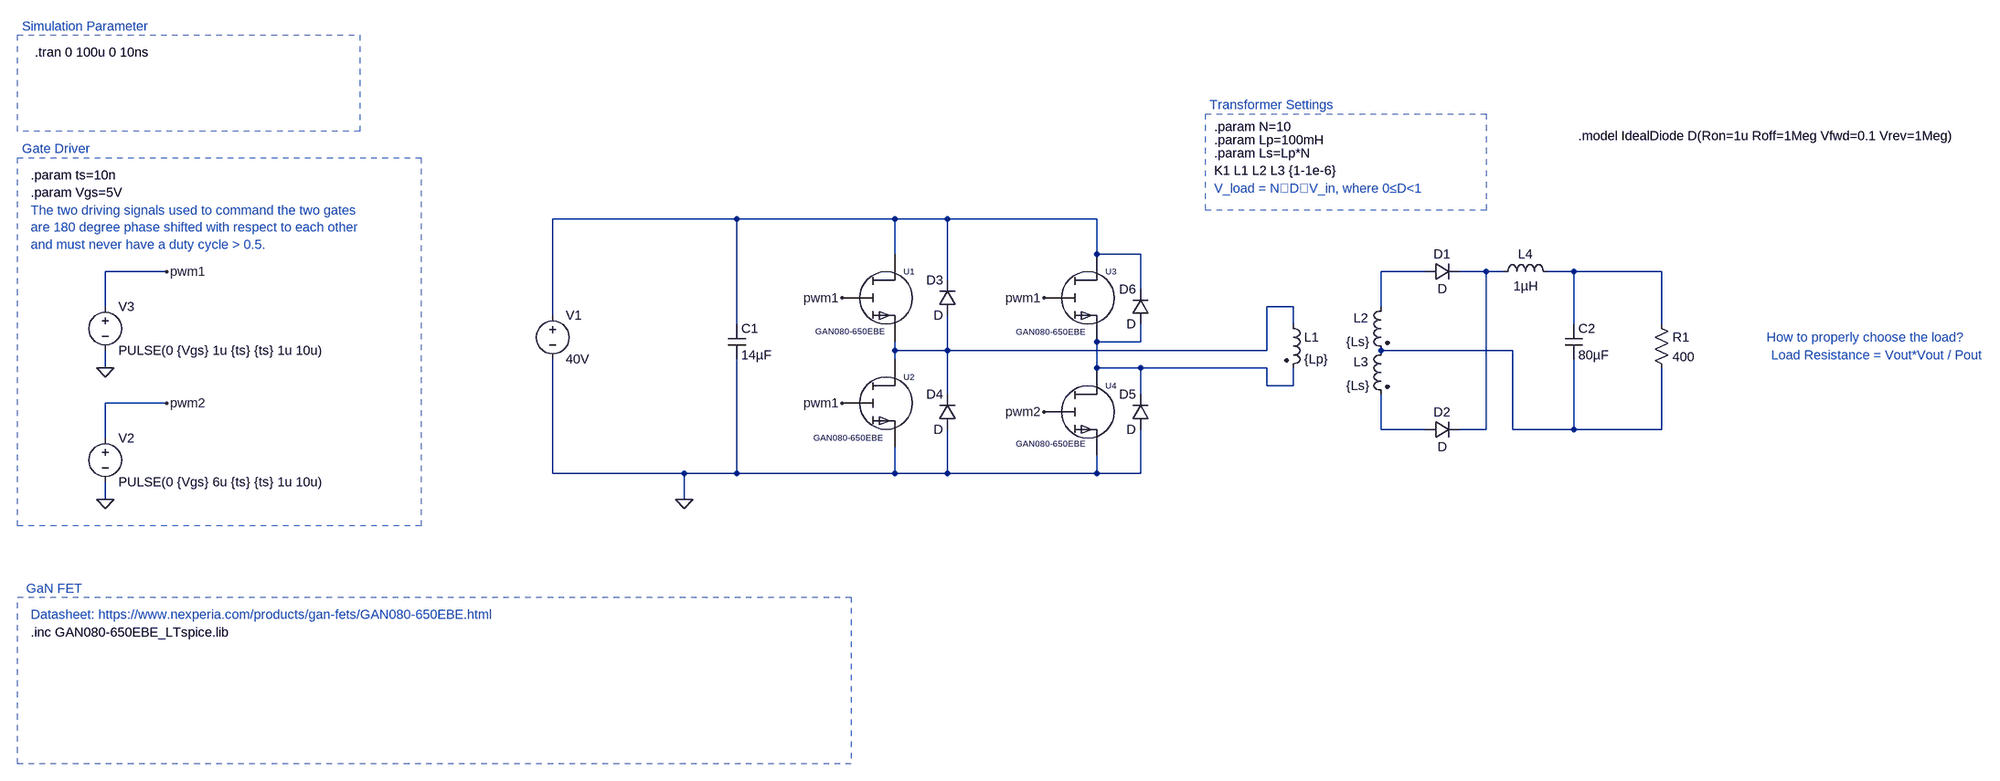
[diagram p0: schematic dc-dc-full-bridge.asc]
dc-dc-full-bridge.asc, the LTspice schematic file:
Version 4
SHEET 1 4648 30344
WIRE 32 -336 -304 -336
WIRE 320 -336 32 -336
WIRE 416 -336 320 -336
WIRE 688 -336 416 -336
WIRE 320 -272 320 -336
WIRE 688 -272 688 -336
WIRE 768 -272 688 -272
WIRE -1008 -240 -1120 -240
WIRE 1328 -240 1248 -240
WIRE 1440 -240 1392 -240
WIRE 1472 -240 1440 -240
WIRE 1600 -240 1552 -240
WIRE 1760 -240 1600 -240
WIRE 416 -224 416 -336
WIRE 768 -208 768 -272
WIRE -1120 -176 -1120 -240
WIRE 1088 -176 1040 -176
WIRE 1248 -176 1248 -240
WIRE -304 -160 -304 -336
WIRE 32 -144 32 -336
WIRE 1088 -144 1088 -176
WIRE 1600 -144 1600 -240
WIRE 1760 -144 1760 -240
WIRE 768 -112 768 -144
WIRE 768 -112 688 -112
WIRE 320 -96 320 -112
WIRE 416 -96 416 -160
WIRE 416 -96 320 -96
WIRE 1040 -96 1040 -176
WIRE 1040 -96 416 -96
WIRE 1488 -96 1248 -96
WIRE 320 -80 320 -96
WIRE -1120 -64 -1120 -96
WIRE 688 -64 688 -112
WIRE 768 -64 688 -64
WIRE 1040 -64 768 -64
WIRE 1040 -32 1040 -64
WIRE 1088 -32 1088 -64
WIRE 1088 -32 1040 -32
WIRE 416 -16 416 -96
WIRE 768 -16 768 -64
WIRE -1008 0 -1120 0
WIRE 1248 48 1248 -16
WIRE 1328 48 1248 48
WIRE 1440 48 1440 -240
WIRE 1440 48 1392 48
WIRE 1488 48 1488 -96
WIRE 1600 48 1600 -80
WIRE 1600 48 1488 48
WIRE 1760 48 1760 -64
WIRE 1760 48 1600 48
WIRE -1120 64 -1120 0
WIRE -304 128 -304 -80
WIRE -64 128 -304 128
WIRE 32 128 32 -80
WIRE 32 128 -64 128
WIRE 320 128 320 80
WIRE 320 128 32 128
WIRE 416 128 416 48
WIRE 416 128 320 128
WIRE 688 128 688 96
WIRE 688 128 416 128
WIRE 768 128 768 48
WIRE 768 128 688 128
WIRE -1120 176 -1120 144
WIRE -64 176 -64 128
FLAG -64 176 0
FLAG -1120 176 0
FLAG -1008 0 pwm2
FLAG -1120 -64 0
FLAG -1008 -240 pwm1
FLAG 224 -192 pwm1
FLAG 224 0 pwm1
FLAG 592 16 pwm2
FLAG 592 -192 pwm1
SYMBOL cap 16 -144 R0
SYMATTR InstName C1
SYMATTR Value 14µF
SYMBOL ind2 1072 -160 R0
SYMATTR InstName L1
SYMATTR Value {Lp}
SYMATTR Type ind
SYMBOL ind2 1264 -192 M0
WINDOW 0 39 37 Left 2
WINDOW 3 37 80 Left 2
SYMATTR InstName L2
SYMATTR Value {Ls}
SYMATTR Type ind
SYMBOL voltage -1120 48 R0
SYMATTR InstName V2
SYMATTR Value PULSE(0 {Vgs} 6u {ts} {ts} 1u 10u)
SYMBOL voltage -1120 -192 R0
SYMATTR InstName V3
SYMATTR Value PULSE(0 {Vgs} 1u {ts} {ts} 1u 10u)
SYMBOL GAN080-650EBE 304 -192 R0
WINDOW 3 -129 61 Left 1
SYMATTR InstName U1
SYMBOL GAN080-650EBE 304 0 R0
WINDOW 3 -132 63 Left 1
SYMATTR InstName U2
SYMBOL voltage -304 -176 R0
SYMATTR InstName V1
SYMATTR Value 40V
SYMBOL GAN080-650EBE 672 -192 R0
WINDOW 3 -131 62 Left 1
SYMATTR InstName U3
SYMBOL GAN080-650EBE 672 16 R0
WINDOW 3 -131 58 Left 1
SYMATTR InstName U4
SYMBOL ind2 1264 -112 M0
WINDOW 0 39 37 Left 2
WINDOW 3 37 80 Left 2
SYMATTR InstName L3
SYMATTR Value {Ls}
SYMATTR Type ind
SYMBOL diode 1328 -224 R270
WINDOW 0 32 32 VTop 2
WINDOW 3 0 32 VBottom 2
SYMATTR InstName D1
SYMBOL diode 1328 64 R270
WINDOW 0 32 32 VTop 2
WINDOW 3 0 32 VBottom 2
SYMATTR InstName D2
SYMBOL cap 1584 -144 R0
SYMATTR InstName C2
SYMATTR Value 80µF
SYMBOL res 1744 -160 R0
SYMATTR InstName R1
SYMATTR Value 400
SYMBOL ind 1456 -224 R270
WINDOW 0 32 56 VTop 2
WINDOW 3 5 56 VBottom 2
SYMATTR InstName L4
SYMATTR Value 1µH
SYMBOL diode 432 -160 R180
WINDOW 0 24 64 Left 2
WINDOW 3 24 0 Left 2
SYMATTR InstName D3
SYMBOL diode 432 48 R180
WINDOW 0 24 64 Left 2
WINDOW 3 24 0 Left 2
SYMATTR InstName D4
SYMBOL diode 784 48 R180
WINDOW 0 24 64 Left 2
WINDOW 3 24 0 Left 2
SYMATTR InstName D5
SYMBOL diode 784 -144 R180
WINDOW 0 24 64 Left 2
WINDOW 3 24 0 Left 2
SYMATTR InstName D6
TEXT 944 -504 Left 2 !.param N=10
TEXT 944 -480 Left 2 !.param Lp=100mH
TEXT 944 -456 Left 2 !.param Ls=Lp*N
TEXT 944 -424 Left 2 !K1 L1 L2 L3 {1-1e-6}
TEXT 1608 -488 Left 2 !.model IdealDiode D(Ron=1u Roff=1Meg Vfwd=0.1 Vrev=1Meg)
TEXT -1272 -464 Left 2 ;Gate Driver
TEXT -1256 -416 Left 2 !.param ts=10n
TEXT -1256 -384 Left 2 !.param Vgs=5V
TEXT -1264 368 Left 2 ;GaN FET
TEXT -1248 -640 Left 2 !.tran 0 100u 0 10ns
TEXT -1256 448 Left 2 !.inc GAN080-650EBE_LTspice.lib
TEXT -1272 -688 Left 2 ;Simulation Parameter
TEXT -1256 416 Left 2 ;Datasheet: https://www.nexperia.com/products/gan-fets/GAN080-650EBE.html
TEXT -1256 -352 Left 2 ;The two driving signals used to command the two gates\nare 180 degree phase shifted with respect to each other\nand must never have a duty cycle > 0.5.
TEXT 1952 -120 Left 2 ;How to properly choose the load?
TEXT 936 -544 Left 2 ;Transformer Settings
TEXT 1960 -88 Left 2 ;Load Resistance = Vout*Vout / Pout
TEXT 944 -392 Left 2 ;V_load = N⋅D⋅V_in, where 0≤D<1
RECTANGLE Normal -544 224 -1280 -448 2
RECTANGLE Normal -656 -496 -1280 -672 2
RECTANGLE Normal 240 688 -1280 384 2
RECTANGLE Normal 1440 -352 928 -528 2

The netlist it stands for:
* dc-dc-full-bridge.asc
C1 N001 0 14µF
L1 N005 N006 {Lp}
L2 N002 N007 {Ls}
V2 pwm2 0 PULSE(0 {Vgs} 6u {ts} {ts} 1u 10u)
V3 pwm1 0 PULSE(0 {Vgs} 1u {ts} {ts} 1u 10u)
XU1 pwm1 N001 N005 GAN080-650EBE  ; pins Gate Drain Source
XU2 pwm1 N005 0 GAN080-650EBE  ; pins Gate Drain Source
V1 N001 0 40V
XU3 pwm1 N001 N006 GAN080-650EBE  ; pins Gate Drain Source
XU4 pwm2 N006 0 GAN080-650EBE  ; pins Gate Drain Source
L3 N007 N008 {Ls}
D1 N002 N003 D
D2 N008 N003 D
C2 N004 N007 80µF
R1 N004 N007 400
L4 N003 N004 1µH
D3 N005 N001 D
D4 0 N005 D
D5 0 N006 D
D6 N006 N001 D
.model D D
.lib standard.dio
.param N=10
.param Lp=100mH
.param Ls=Lp*N
K1 L1 L2 L3 {1-1e-6}
.model IdealDiode D(Ron=1u Roff=1Meg Vfwd=0.1 Vrev=1Meg)
* Gate Driver
.param ts=10n
.param Vgs=5V
* GaN FET
.tran 0 100u 0 10ns
.inc GAN080-650EBE_LTspice.lib
* Simulation Parameter
* Datasheet: https://www.nexperia.com/products/gan-fets/GAN080-650EBE.html
* The two driving signals used to command the two gates
* are 180 degree phase shifted with respect to each other
* and must never have a duty cycle > 0.5.
* How to properly choose the load?
* Transformer Settings
* Load Resistance = Vout*Vout / Pout
* V_load = N⋅D⋅V_in, where 0≤D<1
.lib GAN080-650EBE_LTspice.lib
.backanno
.end